# Altium schematic sheet MCU.SchDoc
size A4
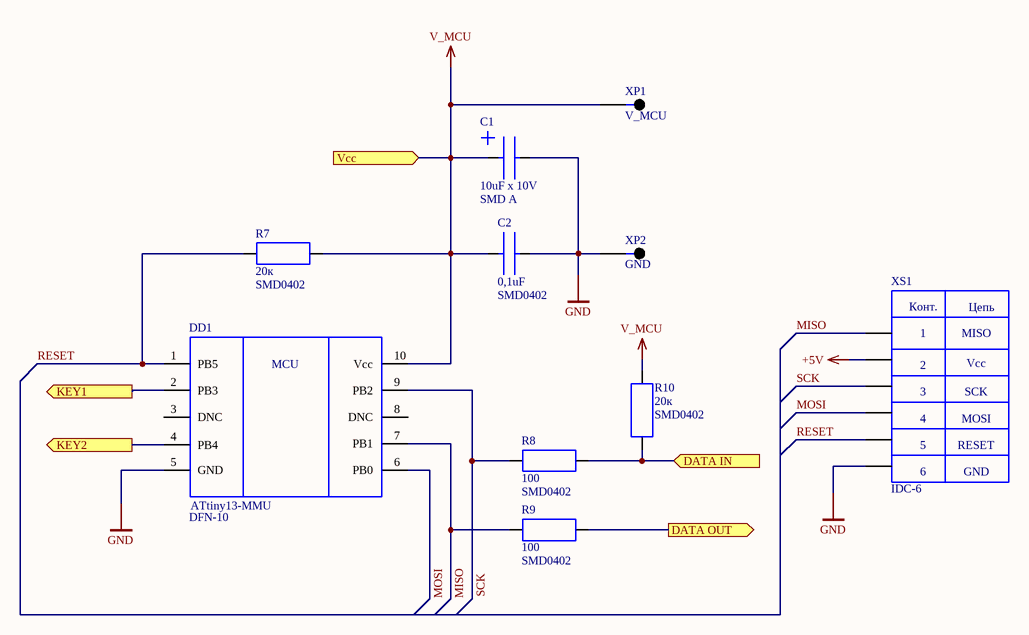
[diagram p0: MCU.SchDoc]

## Parts
C1  10uF x 10V  Package: SMD A  [TANT_CAP_A(3216)]
C2  0,1uF  Package: SMD0402  [SMD0402(1608)]
DD1  ATtiny13-MMU  Package: DFN-10  [QFN-10]
R7  20к  Package: SMD0402  [SMD0402(1608)]
R8  100  Package: SMD0402  [SMD0402(1608)]
R9  100  Package: SMD0402  [SMD0402(1608)]
R10  20к  Package: SMD0402  [SMD0402(1608)]
XP1  V_MCU  [XP_solder]
XP2  GND  [XP_solder]
XS1  IDC-6  [IDC-6 (2.54)]

## Ports
DATA IN (in), DATA OUT (out), KEY1 (out), KEY2 (out), Vcc (in)

## Nets
+5V: XS1.2(DM-)
GND: C1.2 C2.2 DD1.5(GND) XP2.1 XS1.6(DM+)
V_MCU: C1.1 C2.1 DD1.10(Vcc) R7.1 R10.1 XP1.1 ; port Vcc
DATA IN: R8.1 R10.2 ; port DATA IN
DATA OUT: R9.1 ; port DATA OUT
KEY1: DD1.2(PB3) ; port KEY1
KEY2: DD1.4(PB4) ; port KEY2
MISO: DD1.7(PB1) R9.2 XS1.1(+5)
MOSI: DD1.6(PB0) XS1.4(DM+)
RESET: DD1.1(PB5) R7.2 XS1.5(DM+)
SCK: DD1.9(PB2) R8.2 XS1.3(DM+)

Not connected (* = marked no-connect by the designer): DD1 3(DNC) 8(DNC)

## Notes on the sheet
- (in symbol ATtiny13-MMU) MCU
- (in symbol ISP_connector) Конт.; Цепь; MISO; Vcc; SCK; MOSI; RESET; GND

## Library data of the parts
C1 = C_TANT_A: Type: C; ValueBOM: Конденсатор танталовый 10мкФ х 10В SMD A; Value: 10uF x 10V
C2 = CER_CUP_0402: Type: C; ValueBOM: Конденсатор керамический 0,1мкФ х 50В SMD 0402 1%; Value: 0,1uF
DD1 = ATtiny13-MMU: ValueBOM: Микроконтроллер ATtiny13-MMU; Type: DD; Value: ATtiny13-MMU
R7 R10 = R_0402: ValueBOM: Резистор 20кОм SMD 0402 1%; Type: R; Value: 20к
R8 R9 = R_0402: ValueBOM: Резистор 100 Ом SMD 0402 1%; Type: R; Value: 100
XP1 XP2 = XP_solder
XS1 = ISP_connector: Value: IDC-6